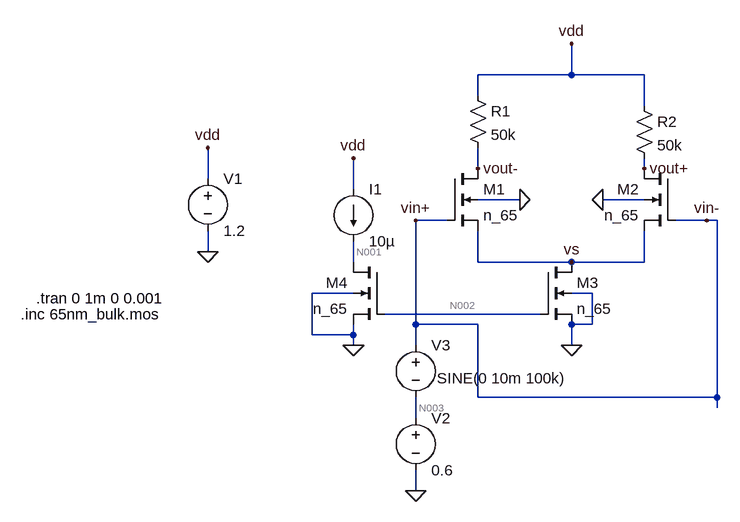
[diagram p0: schematic diff_amp.asc]
diff_amp.asc, the LTspice schematic file:
Version 4.1
SHEET 1 880 680
WIRE 336 -80 336 -128
WIRE 336 -80 192 -80
WIRE 448 -80 336 -80
WIRE 192 -48 192 -80
WIRE 448 -32 448 -80
WIRE 192 64 192 32
WIRE 448 64 448 48
WIRE -224 80 -224 32
WIRE 0 96 0 48
WIRE 256 112 192 112
WIRE 448 112 384 112
WIRE 144 144 96 144
WIRE 544 144 496 144
WIRE 560 144 544 144
WIRE -224 192 -224 160
WIRE 0 208 0 176
WIRE 192 208 192 160
WIRE 336 208 192 208
WIRE 448 208 448 160
WIRE 448 208 336 208
WIRE 0 256 -64 256
WIRE 368 256 336 256
WIRE 288 288 48 288
WIRE 96 304 96 144
WIRE 192 304 96 304
WIRE 368 304 368 256
WIRE 368 304 336 304
WIRE -64 320 -64 256
WIRE 0 320 0 304
WIRE 0 320 -64 320
WIRE 0 336 0 320
WIRE 96 336 96 304
WIRE 336 336 336 304
WIRE 192 416 192 304
WIRE 560 416 560 144
WIRE 560 416 192 416
WIRE 560 432 560 416
WIRE 96 448 96 416
WIRE 96 560 96 528
FLAG 336 336 0
FLAG 256 112 0
FLAG 384 112 0
FLAG 0 336 0
FLAG -224 192 0
FLAG -224 32 vdd
FLAG 0 48 vdd
FLAG 336 -128 vdd
FLAG 96 144 vin+
FLAG 544 144 vin-
FLAG 448 64 vout+
FLAG 192 64 vout-
FLAG 336 208 vs
FLAG 96 560 0
SYMBOL nmos4 144 64 R0
SYMATTR InstName M1
SYMATTR Value n_65
SYMATTR Value2 l=180n w=20u
SYMBOL nmos4 496 64 M0
SYMATTR InstName M2
SYMATTR Value n_65
SYMATTR Value2 l=180n w=20u
SYMBOL nmos4 288 208 R0
SYMATTR InstName M3
SYMATTR Value n_65
SYMATTR Value2 l=300n w=20u
SYMBOL nmos4 48 208 M0
SYMATTR InstName M4
SYMATTR Value n_65
SYMATTR Value2 l=300n w=20u
SYMBOL current 0 96 R0
WINDOW 123 0 0 Left 0
WINDOW 39 0 0 Left 0
SYMATTR InstName I1
SYMATTR Value 10µ
SYMBOL voltage -224 64 R0
WINDOW 123 0 0 Left 0
WINDOW 39 0 0 Left 0
SYMATTR InstName V1
SYMATTR Value 1.2
SYMBOL res 176 -64 R0
SYMATTR InstName R1
SYMATTR Value 50k
SYMBOL res 432 -48 R0
SYMATTR InstName R2
SYMATTR Value 50k
SYMBOL voltage 96 320 R0
WINDOW 123 0 0 Left 0
WINDOW 39 0 0 Left 0
WINDOW 3 33 67 Left 2
SYMATTR InstName V3
SYMATTR Value SINE(0 10m 100k)
SYMBOL voltage 96 432 R0
WINDOW 123 0 0 Left 0
WINDOW 39 0 0 Left 0
SYMATTR InstName V2
SYMATTR Value 0.6
TEXT -512 288 Left 2 !.inc 65nm_bulk.mos
TEXT -488 264 Left 2 !.tran 0 1m 0 0.001

The netlist it stands for:
* diff_amp.asc
M1 vout- vin- vs 0 n_65 l=180n w=20u
M2 vout+ vin- vs 0 n_65 l=180n w=20u
M3 vs N002 0 0 n_65 l=300n w=20u
M4 N001 N002 0 0 n_65 l=300n w=20u
I1 vdd N001 10µ
V1 vdd 0 1.2
R1 vdd vout- 50k
R2 vdd vout+ 50k
V3 vin- N003 SINE(0 10m 100k)
V2 N003 0 0.6
.model NMOS NMOS
.model PMOS PMOS
.lib standard.mos
.inc 65nm_bulk.mos
.tran 0 1m 0 0.001
.backanno
.end

* Results of the author's LTspice run, read from the files saved beside the schematic
* Operating Point, zero values left out:
*   V(vin-) = 600 mV
*   V(vout+) = 958.9 mV
*   V(n002) = 318.7 mV
*   V(vdd) = 1.2 V
*   V(vout-) = 958.9 mV
*   V(vs) = 280.7 mV
*   V(n001) = 719.7 mV
*   V(n003) = 600 mV
*   Id(M1) = 4.821 µA
*   Ig(M1) = -142.5 pA
*   Is(M1) = -4.821 µA
*   Ib(M1) = -1.255 pA
*   I(I1) = 10 µA
*   I(V1) = -19.64 µA
*   I(R2) = 4.821 µA
*   Id(M3) = 9.642 µA
*   Ig(M3) = 369.8 pA
*   Is(M3) = -9.643 µA
*   Id(M4) = 10 µA
*   Ig(M4) = -370.2 pA
*   Is(M4) = -10 µA
*   Id(M2) = 4.821 µA
*   Ig(M2) = -142.5 pA
*   Is(M2) = -4.821 µA
*   Ib(M2) = -1.255 pA
*   I(R1) = 4.821 µA
*   I(V3) = 284.9 pA
*   I(V2) = 284.9 pA
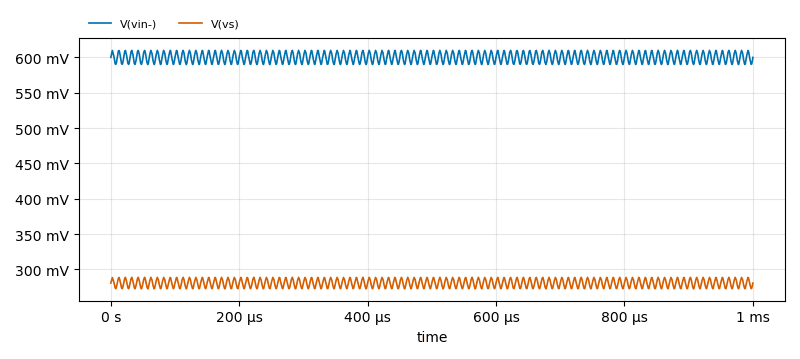
[diagram p1: Transient Analysis of diff_amp.asc, plotted from the saved traces]
* Transient Analysis, 1 run:
*   V(vin-): min 590 mV, max 610 mV, average 600 mV, rms 600.1 mV, last 600 mV
*   V(vs): min 272.5 mV, max 288.8 mV, average 280.7 mV, rms 280.7 mV, last 280.6 mV